# Altium schematic sheet 17-FPGA-02b.SchDoc
size B; SheetNumber: 17; SheetTotal: 22
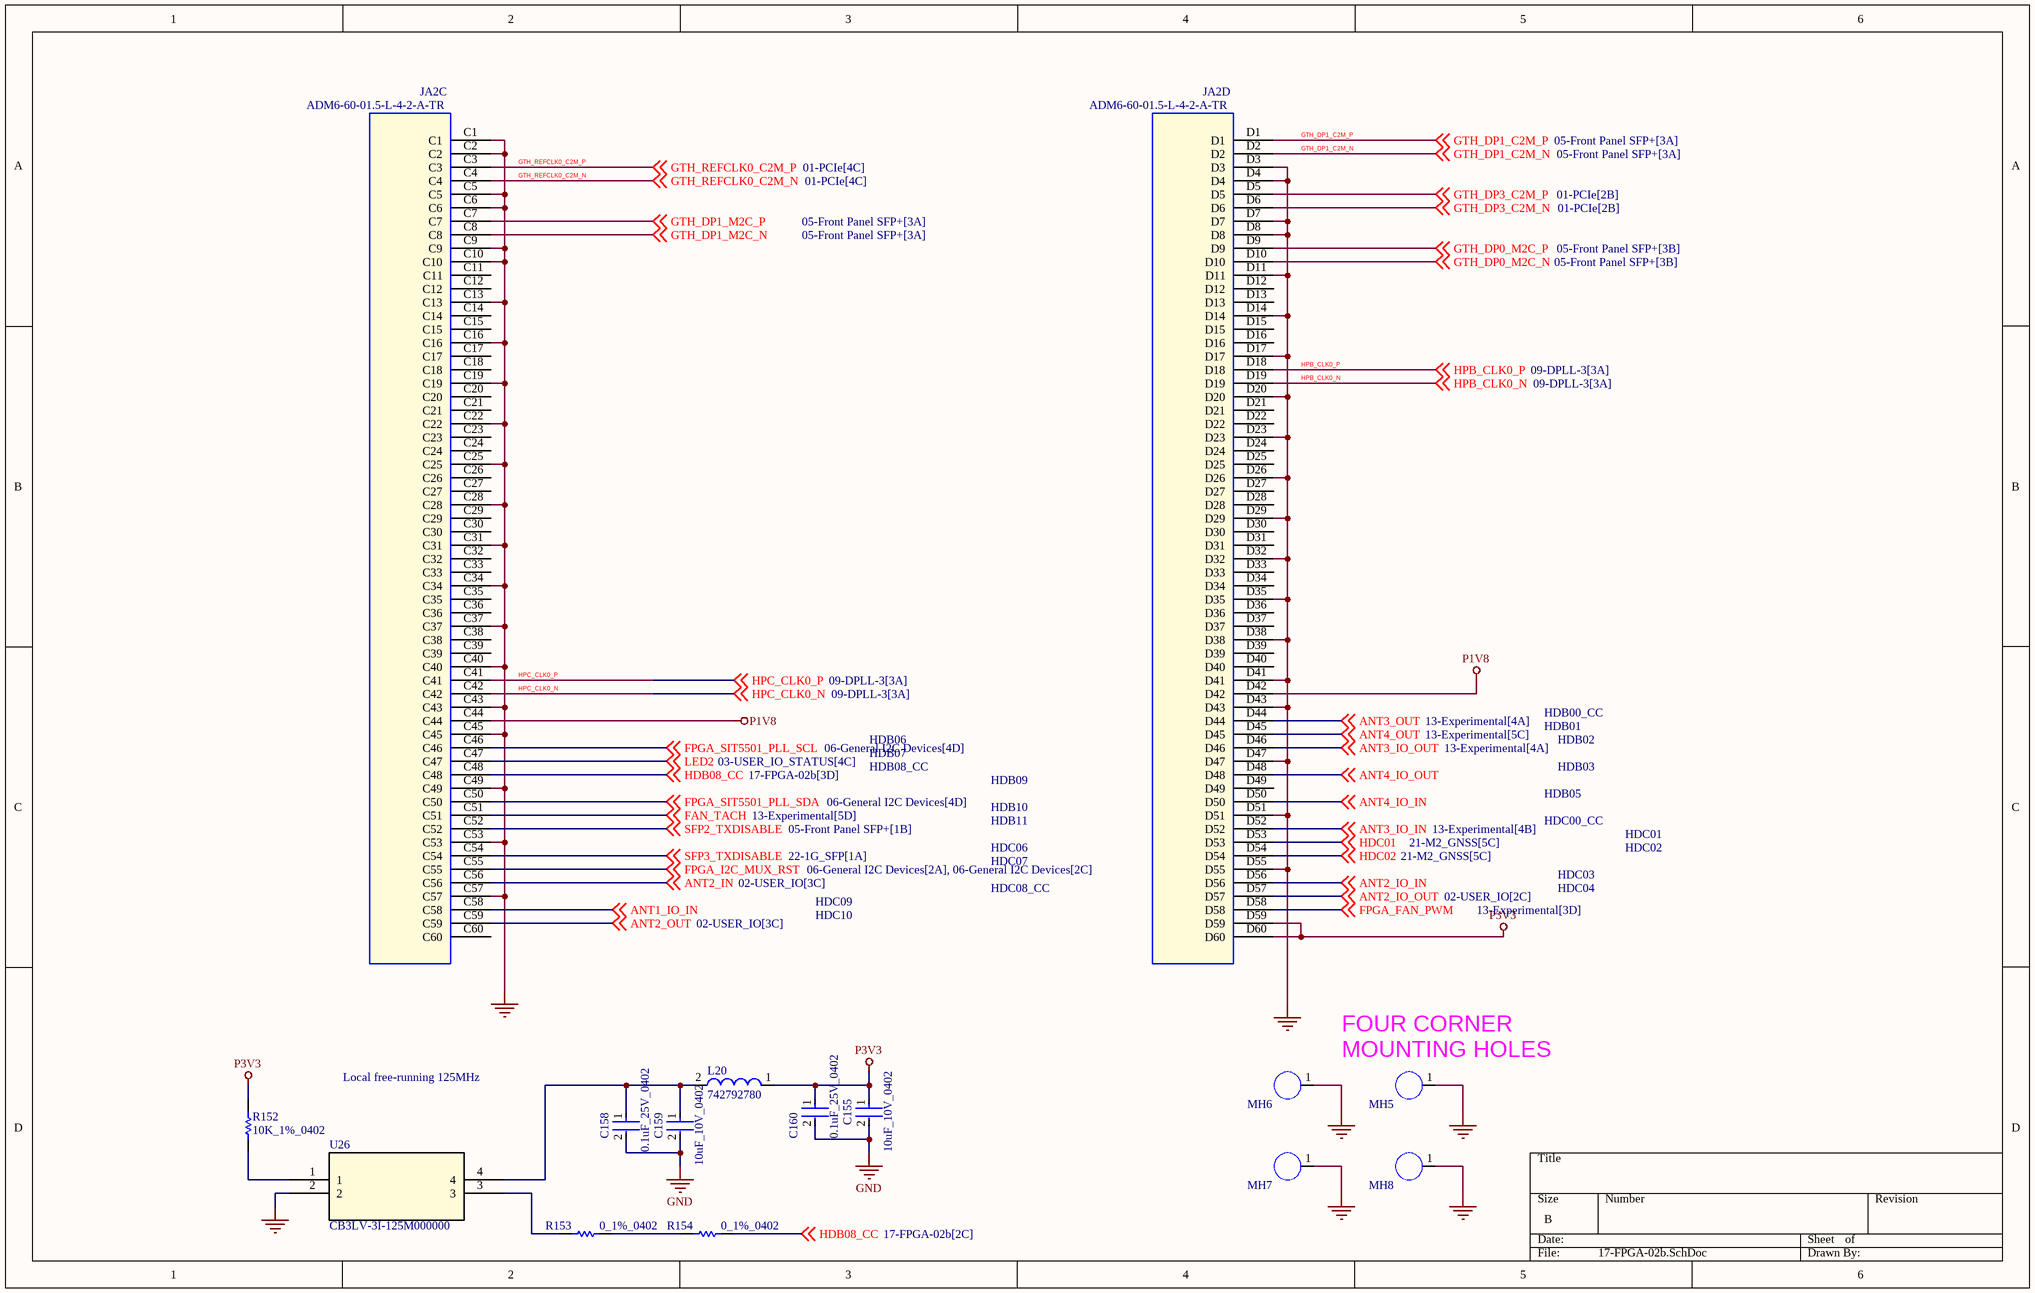
[diagram p0: 17-FPGA-02b.SchDoc]

## Parts
C155  10uF_10V_0402  [FP-CL05A106MP5NUNC-MFG]
C158  0.1uF_25V_0402  [FP-0402-L_1_0_1-W_0_5_0_1-IPC_C]
C159  10uF_10V_0402  [FP-CL05A106MP5NUNC-MFG]
C160  0.1uF_25V_0402  [FP-0402-L_1_0_1-W_0_5_0_1-IPC_C]
JA2  ADM6-60-01.5-L-4-2-A-TR  [CON_SAMTEC_ADM6_60_4]  (parts C,D of 4)
L20  742792780  [SMD-0402]
MH5  MH_NP_M3_SO_600  [MH_NP_M3_SO_600]  (value not drawn)
MH6  MH_NP_M3_SO_600  [MH_NP_M3_SO_600]  (value not drawn)
MH7  MH_NP_M3_SO_600  [MH_NP_M3_SO_600]  (value not drawn)
MH8  MH_NP_M3_SO_600  [MH_NP_M3_SO_600]  (value not drawn)
R152  10K_1%_0402  [RESC1005X40X25LL05T05]
R153  0_1%_0402  [RESC1005X40X25LL05T05]
R154  0_1%_0402  [RESC1005X40X25LL05T05]
U26  CB3LV-3I-125M000000  [CRYS_CB3LV-3I-14M7456_CTS]

## Nets
GND: C155.2 C158.2 C159.2 C160.2 JA2.C1 JA2.C2 JA2.C5 JA2.C6 JA2.C9 JA2.C10 JA2.C13 JA2.C16 JA2.C19 JA2.C22 JA2.C25 JA2.C28 JA2.C31 JA2.C34 JA2.C37 JA2.C40 JA2.C43 JA2.C45 JA2.C49 JA2.C53 JA2.C57 JA2.D3 JA2.D4 JA2.D7 JA2.D8 JA2.D11 JA2.D14 JA2.D17 JA2.D20 JA2.D23 JA2.D26 JA2.D29 JA2.D32 JA2.D35 JA2.D38 JA2.D41 JA2.D43 JA2.D47 JA2.D51 JA2.D55 MH5.1 MH6.1 MH7.1 MH8.1 U26.2
P1V8: JA2.C44 JA2.D42
P3V3: C155.1 C160.1 JA2.D59 JA2.D60 L20.1 R152.2
ANT1_IO_IN: JA2.C58 ; off-sheet ANT1_IO_IN
ANT2_IN: JA2.C56 ; off-sheet ANT2_IN
ANT2_IO_IN: JA2.D56 ; off-sheet ANT2_IO_IN
ANT2_IO_OUT: JA2.D57 ; off-sheet ANT2_IO_OUT
ANT2_OUT: JA2.C59 ; off-sheet ANT2_OUT
ANT3_IO_IN: JA2.D52 ; off-sheet ANT3_IO_IN
ANT3_IO_OUT: JA2.D46 ; off-sheet ANT3_IO_OUT
ANT3_OUT: JA2.D44 ; off-sheet ANT3_OUT
ANT4_IO_IN: JA2.D50 ; off-sheet ANT4_IO_IN
ANT4_IO_OUT: JA2.D48 ; off-sheet ANT4_IO_OUT
ANT4_OUT: JA2.D45 ; off-sheet ANT4_OUT
FAN_TACH: JA2.C51 ; off-sheet FAN_TACH
FPGA_FAN_PWM: JA2.D58 ; off-sheet FPGA_FAN_PWM
FPGA_I2C_MUX_RST: JA2.C55 ; off-sheet FPGA_I2C_MUX_RST
FPGA_SIT5501_PLL_SCL: JA2.C46 ; off-sheet FPGA_SIT5501_PLL_SCL
FPGA_SIT5501_PLL_SDA: JA2.C50 ; off-sheet FPGA_SIT5501_PLL_SDA
GTH_DP0_M2C_N: JA2.D10 ; off-sheet GTH_DP0_M2C_N
GTH_DP0_M2C_P: JA2.D9 ; off-sheet GTH_DP0_M2C_P
GTH_DP1_C2M_N: JA2.D2 ; off-sheet GTH_DP1_C2M_N
GTH_DP1_C2M_P: JA2.D1 ; off-sheet GTH_DP1_C2M_P
GTH_DP1_M2C_N: JA2.C8 ; off-sheet GTH_DP1_M2C_N
GTH_DP1_M2C_P: JA2.C7 ; off-sheet GTH_DP1_M2C_P
GTH_DP3_C2M_N: JA2.D6 ; off-sheet GTH_DP3_C2M_N
GTH_DP3_C2M_P: JA2.D5 ; off-sheet GTH_DP3_C2M_P
GTH_REFCLK0_C2M_N: JA2.C4 ; off-sheet GTH_REFCLK0_C2M_N
GTH_REFCLK0_C2M_P: JA2.C3 ; off-sheet GTH_REFCLK0_C2M_P
HDB08_CC: JA2.C48 R154.2 ; off-sheet HDB08_CC
HDC01: JA2.D53 ; off-sheet HDC01
HDC02: JA2.D54 ; off-sheet HDC02
HPB_CLK0_N: JA2.D19 ; off-sheet HPB_CLK0_N
HPB_CLK0_P: JA2.D18 ; off-sheet HPB_CLK0_P
HPC_CLK0_N: JA2.C42 ; off-sheet HPC_CLK0_N
HPC_CLK0_P: JA2.C41 ; off-sheet HPC_CLK0_P
LED2: JA2.C47 ; off-sheet LED2
SFP2_TXDISABLE: JA2.C52 ; off-sheet SFP2_TXDISABLE
SFP3_TXDISABLE: JA2.C54 ; off-sheet SFP3_TXDISABLE
NetC158_1: C158.1 C159.1 L20.2 U26.4
NetR152_1: R152.1 U26.1
NetR153_1: R153.1 U26.3
NetR153_2: R153.2 R154.1

Not connected (* = marked no-connect by the designer): JA2 C11 C12 C14 C15 C17 C18 C20 C21 C23 C24 C26 C27 C29 C30 C32 C33 C35 C36 C38 C39 C60 D12 D13 D15 D16 D21 D22 D24 D25 D27 D28 D30 D31 D33 D34 D36 D37 D39 D40 D49

## Notes on the sheet
- HDB06
- HDB07
- HDB08_CC
- HDB00_CC
- HDB01
- HDB02
- HDB03
- HDB09
- HDB10
- HDB11
- HDC00_CC
- HDB05
- HDC01
- HDC09
- HDC06
- HDC07
- HDC08_CC
- HDC03
- HDC04
- HDC02
- HDC10
- Local free-running 125MHz
- (near MH5) FOUR CORNER
  MOUNTING HOLES

## Library data of the parts
C155 C159 = CMP-13271-000002-1: CAP CER 10UF 10V X5R 0402; Manufacturer Part Number: CL05A106MP5NUNC; Manufacturer: Samsung; Temperature Coefficient: 15%; Tolerance: 20%; Material: Ceramic; Octopart: https://octopart.com/cl05a106mp5nunc-samsung-22457395; Voltage Rating: 10V; RoHS: TRUE; Value: 10uF; Height: 0.7mm; Digikey Description: CAP CER 10UF 10V X5R 0402; Automotive: No; Package: CL05A106MP5NUNC; Device Class L1: Passive Components; Capacitance: 10uF; Temperature Range High: +85°C; ComponentLink2Description: Datasheet; Device Class L2: Capacitors; Temperature Characteristic: X5R; Temperature: -55°C to +85°C; ComponentLink2URL: http://www.samsungsem.com/kr/support/product-search/mlcc/__icsFiles/afieldfile/2019/05/10/19-CL05A106MP5NUNC.pdf; Device Class L3: Ceramic Capacitors; Category: Cap; Temperature Range Low: -55°C; Ipc Land Pattern Name: CAPC10050X50; Lead Free: Yes
C158 C160 = CMP-2008-02519-2: General Purpose Ceramic Capacitor, 0402, 100nF, 10%, X7R, 15%, 25V; Package Quantity: 1; Capacitance: 100nF; Min Operating Temperature: -55°C; Voltage: 25V; Voltage Rating: 25V; Construction: Flat; Max Operating Temperature: 125°C; Radiation Hardening: No; Depth: 0.5mm; Thickness: 0.022inch; Voltage Rating (DC): 25V; Number of Pins: 2; Lead Free: Lead Free; Series: -; REACH SVHC: No SVHC; Length: 1mm; Dielectric: X7R; RoHS Compliant: Yes; Mount: Surface Mount; Packaging: Tape and Reel; Case/Package: 0402; Case Code (Imperial): 0402; Termination: SMD/SMT; Width: 0.02inch; Case Code (Metric): 1005; Tolerance: 10%
JA2 = SAMTEC-ADx6-60X4: Conn Rcpt Male Vert 240 Pos 4x60 0.635mm P Black SMT; Manufacturer: Samtec Inc.; Agile Part Number: CON-00383-01; SPLIT_INST: TRUE; SWAP_INFO: (S1+S2+S3+S4); Barcode: 40000092; Pitch: 0.025" (0.64mm); Datasheet: http://suddendocs.samtec.com/catalog_english/adf6.pdf; Manufacturer PN: ADM6-60-01.5-L-4-2-A-TR; PCB Footprint: CON_SAMTEC_ADM6_60_4; Part Type: CONNECTOR; Number of Pins: 240; CIP Link: http://xsjbrdwin1/CIP-E/Component/Index/All?pn=40000092
L20 = CMP-0220-00137-1: SMD EMI Suppression Ferrite Bead WE-CBF, Z = 220 Ohm; Impedance: 220 Ohm; PackageVersion: 2009; DatasheetVersion: ver 4, Jul-2009; PackageDescription: Chip Inductor, 2-Leads, Body 1.0 x 0.5 mm; ComponentLink1URL: http://www.we-online.com; ComponentLink1Description: Manufacturer Link; ComponentLink2URL: http://www.we-online.de/katalog/media/pdf/742792780.pdf; PackageReference: SMD-0402; ComponentLink2Description: Datasheet
MH5-MH8 = HOLE: MOUNTING HOLE, NON-PLATED 3.4MM HOLE; EDMVersionID: 490415297; Barcode: 96000044; ASSEMBLY_OPTIONS: DNP; PCB Footprint: MH_NP_M3_SO_600; CIP Link: http://xsjbrdwin1/CIP-E/Component/Index/All?pn=96000044; Part Type: HOLE
R152 = CMP-2000-07588-1: Chip Resistor, 10 KOhm, +/- 1%, 0.1 W, -55 to 155 degC, 0402 (1005 Metric), RoHS, Tape and Reel; Manufacturer: Panasonic; Power Rating: 100mW; Voltage Rating: 50V; Resistance: 10KOhm; Case\/Package: 0402; Temperature Coefficient: 100ppm\/degreesC; RoHSCompliant: True; Lead Free: LeadFree; Package Quantity: 1; Contact Plating: Tin; Length: 1mm; Radiation Hardening: No; REACH SVHC: NoSVHC; Max Operating Temperature: 155degC; Depth: 0.5mm; Case Code (Imperial): 0402; Military Standard: Not; Package Description: 2-Pin Surface Mount Device, Body 1 x 0.5 mm; Termination: SMD/SMT; Case Code (Metric): 1005; Height: 0.35mm; Packaging: TapeandReel; Voltage Rating (DC): 50V; Package Reference: 402; Number of Pins: 2; Tolerance: 1%; Mounting Technology: SurfaceMount; Width: 0.02inch; Mount: SurfaceMount; Datasheet URL: https://industrial.panasonic.com/cdbs/www-data/pdf/RDA0000/AOA0000C304.pdf; Composition: ThickFilm; Datasheet Version: 02/2017; Manufacturer URL: http://www.panasonic.com/; Max Power Dissipation: 100mW; Number of Terminations: 2; Min Operating Temperature: -55degC
R153 R154 = CMP-2000-07451-1: Chip Resistor, 0 Ohm, 0.1 W, -55 to 155 degC, 0402 (1005 Metric), RoHS, Tape and Reel; Manufacturer: Panasonic; Voltage Rating (DC): 50V; Temperature Coefficient: 600ppm/��C; Max Power Dissipation: 100mW; Resistance: 0mOhm; Tolerance: 5%; Number of Terminations: 2; Mount: SurfaceMount; Height: 0.35mm; Packaging: TapeandReel; Contact Plating: Tin; Manufacturer URL: http://www.panasonic.com/; Composition: ThickFilm; Max Operating Temperature: 155degC; REACH SVHC: NoSVHC; Case/Package: 0402; Package Reference: 402; Depth: 0.5mm; Package Description: 2-Pin Surface Mount Device, Body 1 x 0.5 mm; Datasheet URL: https://industrial.panasonic.com/cdbs/www-data/pdf/RDA0000/AOA0000C301.pdf; RoHSCompliant: True; Case Code (Imperial): 0402; Military Standard: Not; Min Operating Temperature: -55degC; Power Rating: 100mW; Datasheet Version: 03/2015; Length: 1mm; Case Code (Metric): 1005; Termination: SMD/SMT; Mounting Technology: SurfaceMount; Voltage Rating: 50V; Width: 0.02inch; Package Quantity: 1; Lead Free: LeadFree; Radiation Hardening: No
U26 = CB3LV-3I-14M7456: No Description Available; Mfr_Name: CTS Components; RefDes: RefDes; Type: Type; Supplier 1: Avnet; Supplier Part Number 1: CB3LV-3I-125M00000